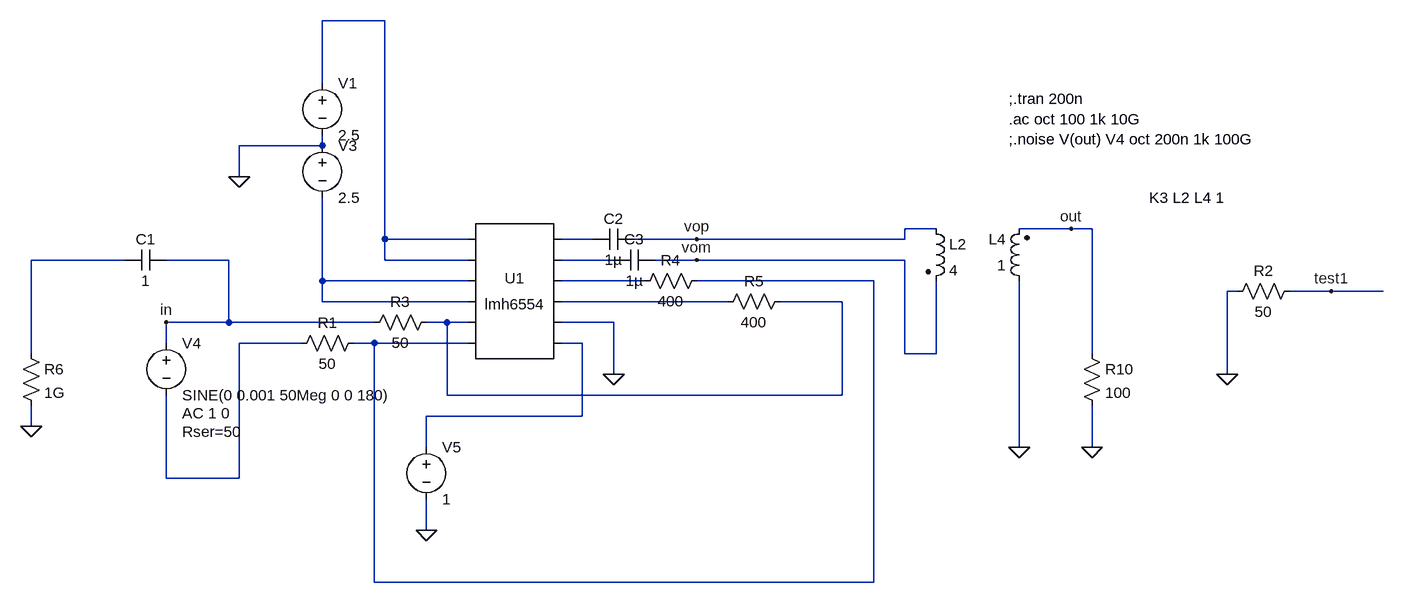
[diagram p0: schematic lmh6554.asc]
lmh6554.asc, the LTspice schematic file:
Version 4
SHEET 1 1668 716
WIRE 128 -256 32 -256
WIRE 32 -160 32 -256
WIRE 32 -64 32 -80
WIRE 32 -64 -96 -64
WIRE -96 -16 -96 -64
WIRE 976 64 928 64
WIRE 1184 64 1104 64
WIRE 1216 64 1184 64
WIRE 128 80 128 -256
WIRE 256 80 128 80
WIRE 448 80 400 80
WIRE 608 80 512 80
WIRE 928 80 928 64
WIRE 928 80 608 80
WIRE -272 112 -416 112
WIRE -112 112 -208 112
WIRE 128 112 128 80
WIRE 256 112 128 112
WIRE 480 112 400 112
WIRE 608 112 544 112
WIRE 928 112 608 112
WIRE 32 144 32 16
WIRE 256 144 32 144
WIRE 528 144 400 144
WIRE 880 144 608 144
WIRE 1440 160 1424 160
WIRE 1584 160 1520 160
WIRE 1664 160 1584 160
WIRE 32 176 32 144
WIRE 256 176 32 176
WIRE 656 176 400 176
WIRE 832 176 736 176
WIRE -112 208 -112 112
WIRE -112 208 -208 208
WIRE 112 208 -112 208
WIRE 224 208 192 208
WIRE 256 208 224 208
WIRE 480 208 400 208
WIRE -208 240 -208 208
WIRE 0 240 -96 240
WIRE 112 240 80 240
WIRE 256 240 112 240
WIRE 432 240 400 240
WIRE -416 256 -416 112
WIRE 928 256 928 112
WIRE 976 256 976 144
WIRE 976 256 928 256
WIRE 1216 256 1216 64
WIRE 480 288 480 208
WIRE 1424 288 1424 160
WIRE 224 320 224 208
WIRE 832 320 832 176
WIRE 832 320 224 320
WIRE 432 352 432 240
WIRE 432 352 192 352
WIRE -416 368 -416 336
WIRE 192 400 192 352
WIRE 1104 400 1104 144
WIRE 1216 400 1216 336
WIRE -208 448 -208 320
WIRE -96 448 -96 240
WIRE -96 448 -208 448
WIRE 192 528 192 480
WIRE 112 608 112 240
WIRE 880 608 880 144
WIRE 880 608 112 608
FLAG -96 -16 0
FLAG 480 288 0
FLAG 192 528 0
FLAG 1104 400 0
FLAG 1216 400 0
FLAG 1184 64 out
FLAG -208 208 in
FLAG 608 112 vom
FLAG 608 80 vop
FLAG 1424 288 0
FLAG 1584 160 test1
FLAG -416 368 0
SYMBOL AutoGenerated\\lmh6554 320 160 R0
SYMATTR InstName U1
SYMBOL voltage 32 -176 R0
WINDOW 123 0 0 Left 2
WINDOW 39 0 0 Left 2
SYMATTR InstName V1
SYMATTR Value 2.5
SYMBOL voltage 32 -80 R0
WINDOW 123 0 0 Left 2
WINDOW 39 0 0 Left 2
SYMATTR InstName V3
SYMATTR Value 2.5
SYMBOL voltage 192 384 R0
WINDOW 123 0 0 Left 2
WINDOW 39 0 0 Left 2
SYMATTR InstName V5
SYMATTR Value 1
SYMBOL voltage -208 224 R0
WINDOW 123 24 124 Left 2
WINDOW 39 24 152 Left 2
SYMATTR Value2 AC 1 0
SYMATTR SpiceLine Rser=50
SYMATTR InstName V4
SYMATTR Value SINE(0 0.001 50Meg 0 0 180)
SYMBOL res 96 224 R90
WINDOW 0 0 56 VBottom 2
WINDOW 3 32 56 VTop 2
SYMATTR InstName R1
SYMATTR Value 50
SYMBOL res 208 192 R90
WINDOW 0 0 56 VBottom 2
WINDOW 3 32 56 VTop 2
SYMATTR InstName R3
SYMATTR Value 50
SYMBOL res 624 128 R90
WINDOW 0 0 56 VBottom 2
WINDOW 3 32 56 VTop 2
SYMATTR InstName R4
SYMATTR Value 400
SYMBOL res 752 160 R90
WINDOW 0 0 56 VBottom 2
WINDOW 3 32 56 VTop 2
SYMATTR InstName R5
SYMATTR Value 400
SYMBOL res 1200 240 R0
SYMATTR InstName R10
SYMATTR Value 100
SYMBOL ind2 960 48 R0
SYMATTR InstName L2
SYMATTR Value 4
SYMATTR Type ind
SYMBOL ind2 1120 160 R180
WINDOW 0 36 80 Left 2
WINDOW 3 36 40 Left 2
SYMATTR InstName L4
SYMATTR Value 1
SYMATTR Type ind
SYMBOL cap 512 64 R90
WINDOW 0 0 32 VBottom 2
WINDOW 3 32 32 VTop 2
SYMATTR InstName C2
SYMATTR Value 1µ
SYMBOL cap 544 96 R90
WINDOW 0 0 32 VBottom 2
WINDOW 3 32 32 VTop 2
SYMATTR InstName C3
SYMATTR Value 1µ
SYMBOL res 1536 144 R90
WINDOW 0 0 56 VBottom 2
WINDOW 3 32 56 VTop 2
SYMATTR InstName R2
SYMATTR Value 50
SYMBOL cap -208 96 R90
WINDOW 0 0 32 VBottom 2
WINDOW 3 32 32 VTop 2
SYMATTR InstName C1
SYMATTR Value 1
SYMBOL res -432 240 R0
SYMATTR InstName R6
SYMATTR Value 1G
TEXT 1088 -136 Left 2 !;.tran 200n\n.ac oct 100 1k 10G\n;.noise V(out) V4 oct 200n 1k 100G
TEXT 1304 16 Left 2 !K3 L2 L4 1

The netlist it stands for:
* lmh6554.asc
* U1: lmh6554 (symbol AutoGenerated\lmh6554 not available, pins judged from their places): pin1=N001 pin2=N001 pin3=N005 pin4=N005 pin5=N009 pin6=N007 pin7=N002 pin8=N004 pin9=N006 pin10=N008 pin11=0 pin12=N011
V1 N001 0 2.5
V3 0 N005 2.5
V5 N011 0 1
V4 in N010 SINE(0 0.001 50Meg 0 0 180) AC 1 0 Rser=50
R1 N007 N010 50
R3 N009 in 50
R4 N007 N006 400
R5 N009 N008 400
R10 out 0 100
L2 vop vom 4
L4 0 out 1
C2 vop N002 1µ
C3 vom N004 1µ
R2 test1 0 50
C1 in N003 1
R6 N003 0 1G
;.tran 200n
.ac oct 100 1k 10G
;.noise V(out) V4 oct 200n 1k 100G
K3 L2 L4 1
.backanno
.end